# Altium schematic sheet Auxiliary.SchDoc: main_assy PCB
size A4
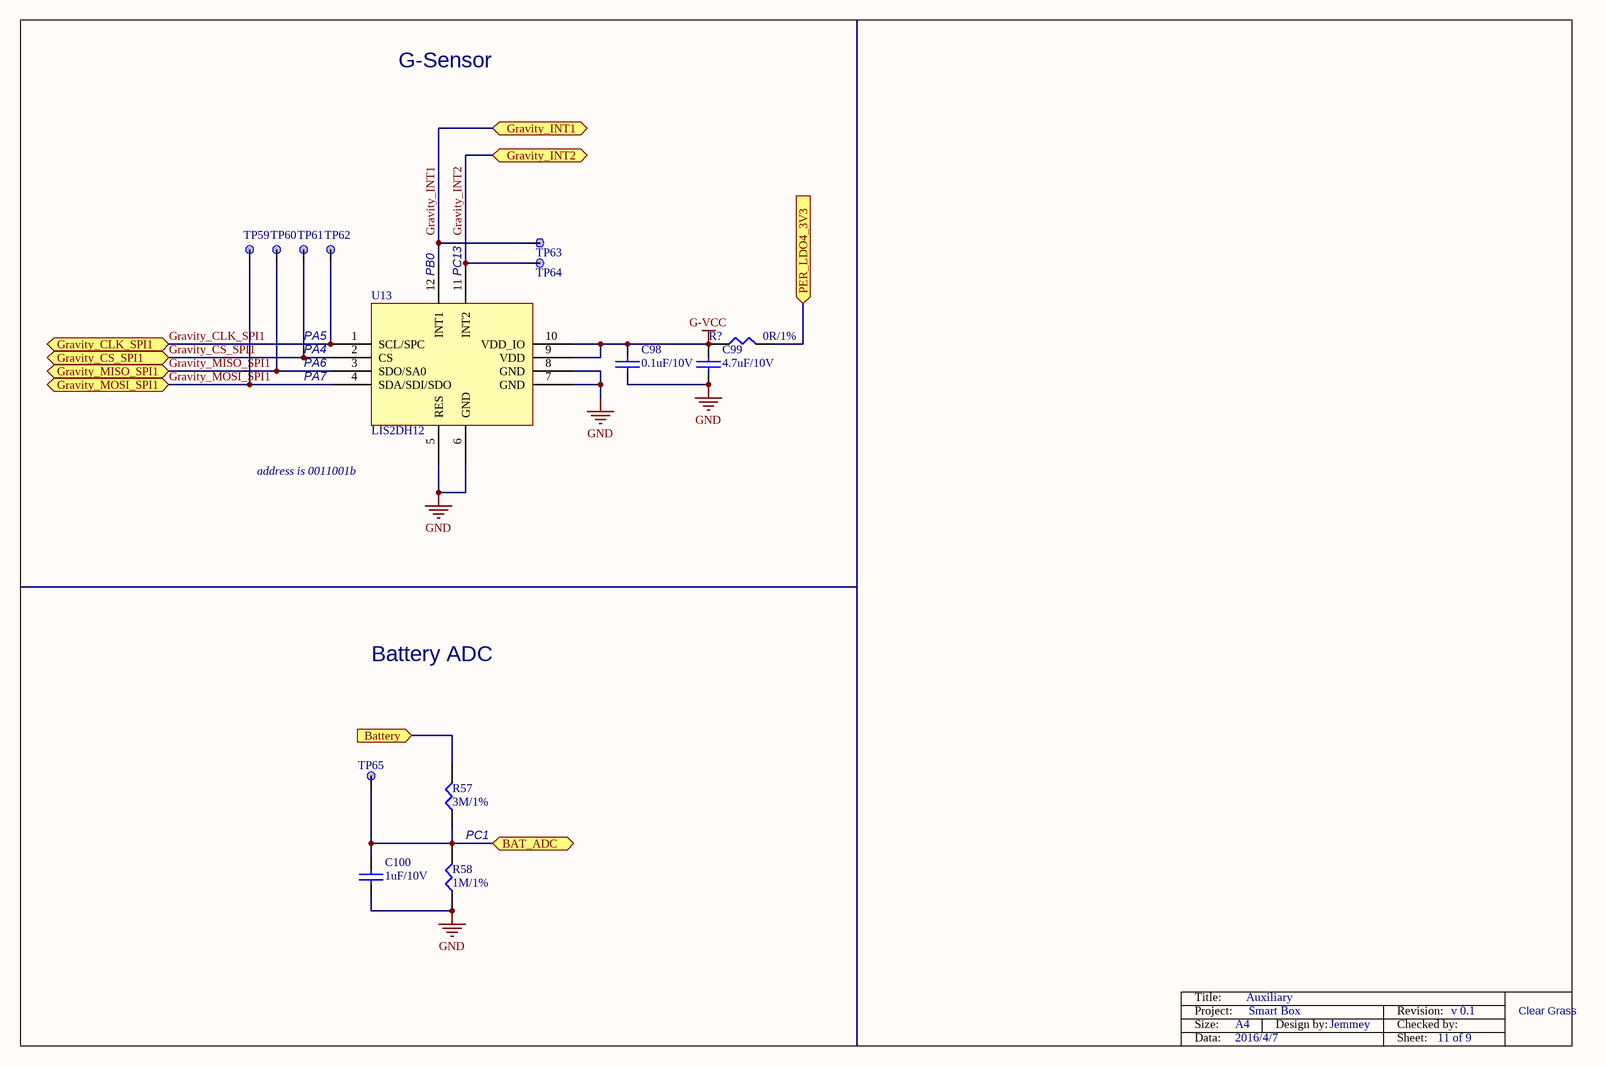
[diagram p0: Auxiliary.SchDoc]

## Parts
C98  0.1uF/10V  [0402C]
C99  4.7uF/10V  [0603C]
C100  1uF/10V  [0402C]
R57  3M/1%  [0402R]
R58  1M/1%  [0402R]
R?  0R/1%  [0402R]
TP59  TP  [TP_C40]  (value not drawn)
TP60  TP  [TP_C40]  (value not drawn)
TP61  TP  [TP_C40]  (value not drawn)
TP62  TP  [TP_C40]  (value not drawn)
TP63  TP  [TP_C40]  (value not drawn)
TP64  TP  [TP_C40]  (value not drawn)
TP65  TP  [TP_C40]  (value not drawn)
U13  LIS2DH12

## Ports
BAT_ADC, Battery (in), Gravity_CLK_SPI1 (bidir), Gravity_CS_SPI1 (bidir), Gravity_INT1 (bidir), Gravity_INT2 (bidir), Gravity_MISO_SPI1 (bidir), Gravity_MOSI_SPI1 (bidir), PER_LDO4_3V3 (in)

## Nets
G-VCC: C98.1 C99.1 R?.1 U13.9(VDD) U13.10(VDD_IO)
GND: C98.2 C99.2 C100.2 R58.1 U13.5(RES) U13.6(GND) U13.7(GND) U13.8(GND)
BAT_ADC: C100.1 R57.1 R58.2 TP65.1 ; port BAT_ADC
Battery: R57.2 ; port Battery
Gravity_CLK_SPI1: TP62.1 U13.1(SCL/SPC) ; port Gravity_CLK_SPI1
Gravity_CS_SPI1: TP61.1 U13.2(CS) ; port Gravity_CS_SPI1
Gravity_INT1: TP63.1 U13.12(INT1) ; port Gravity_INT1
Gravity_INT2: TP64.1 U13.11(INT2) ; port Gravity_INT2
Gravity_MISO_SPI1: TP60.1 U13.3(SDO/SA0) ; port Gravity_MISO_SPI1
Gravity_MOSI_SPI1: TP59.1 U13.4(SDA/SDI/SDO) ; port Gravity_MOSI_SPI1
PER_LDO4_3V3: R?.2 ; port PER_LDO4_3V3

## Notes on the sheet
- G-Sensor
- (near U13) PB0
- (near U13) PC13
- (near U13) PA7
- (near U13) PA6
- (near U13) PA4
- (near U13) PA5
- (near U13) address is 0011001b
- Battery ADC
- PC1
- Title:
- Auxiliary
- Project:
- Size:
- Data:
- A4
- 2016/4/7
- Smart Box
- Design by:
- Jemmey
- Revision:
- Sheet:
- Checked by:
- 11 of 9
- v 0.1
- Clear Grass

## Library data of the parts
C98 C100 = CAP: 厂家：Murata，型号：GRM155R71A104KA01D
C99 = CAP: 厂家：Murata，型号：GRM188R61A106KE69D
R57 R58 R? = RES1: 厂家：Yageo，型号：RC0402FR-0710KL
TP59-TP65 = TP: Ordered by: Subcon
U13 = LI: 厂家：ST，型号：LIS2DH12